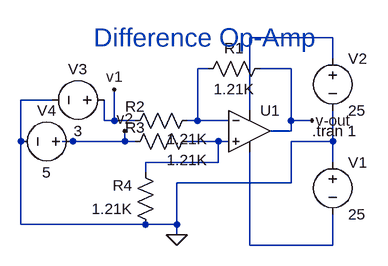
[diagram p0: schematic 6.DifferenceAmplifier.asc]
6.DifferenceAmplifier.asc, the LTspice schematic file:
Version 4.1
SHEET 1 880 680
WIRE 464 -48 336 -48
WIRE 464 -16 464 -48
WIRE 272 0 256 0
WIRE 400 0 352 0
WIRE 32 48 -16 48
WIRE 336 64 336 -48
WIRE 112 80 112 48
WIRE 128 80 128 32
WIRE 128 80 112 80
WIRE 160 80 128 80
WIRE 256 80 256 0
WIRE 256 80 240 80
WIRE 304 80 256 80
WIRE 400 80 400 0
WIRE 432 80 400 80
WIRE 400 96 400 80
WIRE 400 96 368 96
WIRE -16 112 -16 48
WIRE 64 112 48 112
WIRE 144 112 144 96
WIRE 144 112 64 112
WIRE 160 112 144 112
WIRE 288 112 240 112
WIRE 304 112 288 112
WIRE 464 112 464 64
WIRE 464 112 400 112
WIRE 288 144 288 112
WIRE 288 144 176 144
WIRE 464 144 464 112
WIRE 176 160 176 144
WIRE 400 176 400 112
WIRE 400 176 224 176
WIRE -16 240 -16 112
WIRE 176 240 -16 240
WIRE 224 240 224 176
WIRE 224 240 176 240
WIRE 224 256 224 240
WIRE 336 272 336 128
WIRE 464 272 464 224
WIRE 464 272 336 272
FLAG 224 256 0
FLAG 432 80 v-out
FLAG 128 32 v1
FLAG 144 96 v2
SYMBOL OpAmps\\UniversalOpAmp2 336 96 R0
SYMATTR InstName U1
SYMBOL res 368 -16 R90
WINDOW 0 0 56 VBottom 2
WINDOW 3 32 56 VTop 2
SYMATTR InstName R1
SYMATTR Value 1.21K
SYMATTR SpiceLine tol=1 pwr=0.1
SYMBOL voltage 464 128 R0
WINDOW 123 0 0 Left 0
WINDOW 39 0 0 Left 0
SYMATTR InstName V1
SYMATTR Value 25
SYMBOL voltage 464 -32 R0
WINDOW 123 0 0 Left 0
WINDOW 39 0 0 Left 0
SYMATTR InstName V2
SYMATTR Value 25
SYMBOL res 256 96 R90
WINDOW 0 10 96 VBottom 2
WINDOW 3 29 16 VTop 2
SYMATTR InstName R3
SYMATTR Value 1.21K
SYMATTR SpiceLine tol=1 pwr=0.1
SYMBOL voltage 128 48 R90
WINDOW 0 -32 56 VBottom 2
WINDOW 3 32 56 VTop 2
WINDOW 123 0 0 Left 0
WINDOW 39 0 0 Left 0
SYMATTR InstName V3
SYMATTR Value 3
SYMBOL voltage 80 112 R90
WINDOW 0 -32 56 VBottom 2
WINDOW 3 32 56 VTop 2
WINDOW 123 0 0 Left 0
WINDOW 39 0 0 Left 0
SYMATTR InstName V4
SYMATTR Value 5
SYMBOL res 256 64 R90
WINDOW 0 10 96 VBottom 2
WINDOW 3 29 16 VTop 2
SYMATTR InstName R2
SYMATTR Value 1.21K
SYMATTR SpiceLine tol=1 pwr=0.1
SYMBOL res 192 256 R180
WINDOW 0 36 76 Left 2
WINDOW 3 36 40 Left 2
SYMATTR InstName R4
SYMATTR Value 1.21K
SYMATTR SpiceLine tol=1 pwr=0.1
TEXT 432 96 Left 2 !.tran 1
TEXT 96 -48 Left 4 ;Difference Op-Amp

The netlist it stands for:
* 6.DifferenceAmplifier.asc
X§U1 N003 N002 N001 N004 v-out level2 Avol=1Meg GBW=10Meg Slew=10Meg Ilimit=25m Rail=0 Vos=0 En=0 Enk=0 In=0 Ink=0 Rin=500Meg  ; pins In+ In- V+ V- OUT
R1 v-out N002 1.21K tol=1 pwr=0.1
V1 0 N004 25
V2 N001 0 25
R3 N003 v2 1.21K tol=1 pwr=0.1
V3 v1 0 3
V4 v2 0 5
R2 N002 v1 1.21K tol=1 pwr=0.1
R4 0 N003 1.21K tol=1 pwr=0.1
.tran 1
* Difference Op-Amp
.lib UniversalOpAmp2.lib
.backanno
.end